# Altium schematic sheet PSU.SchDoc
size A3
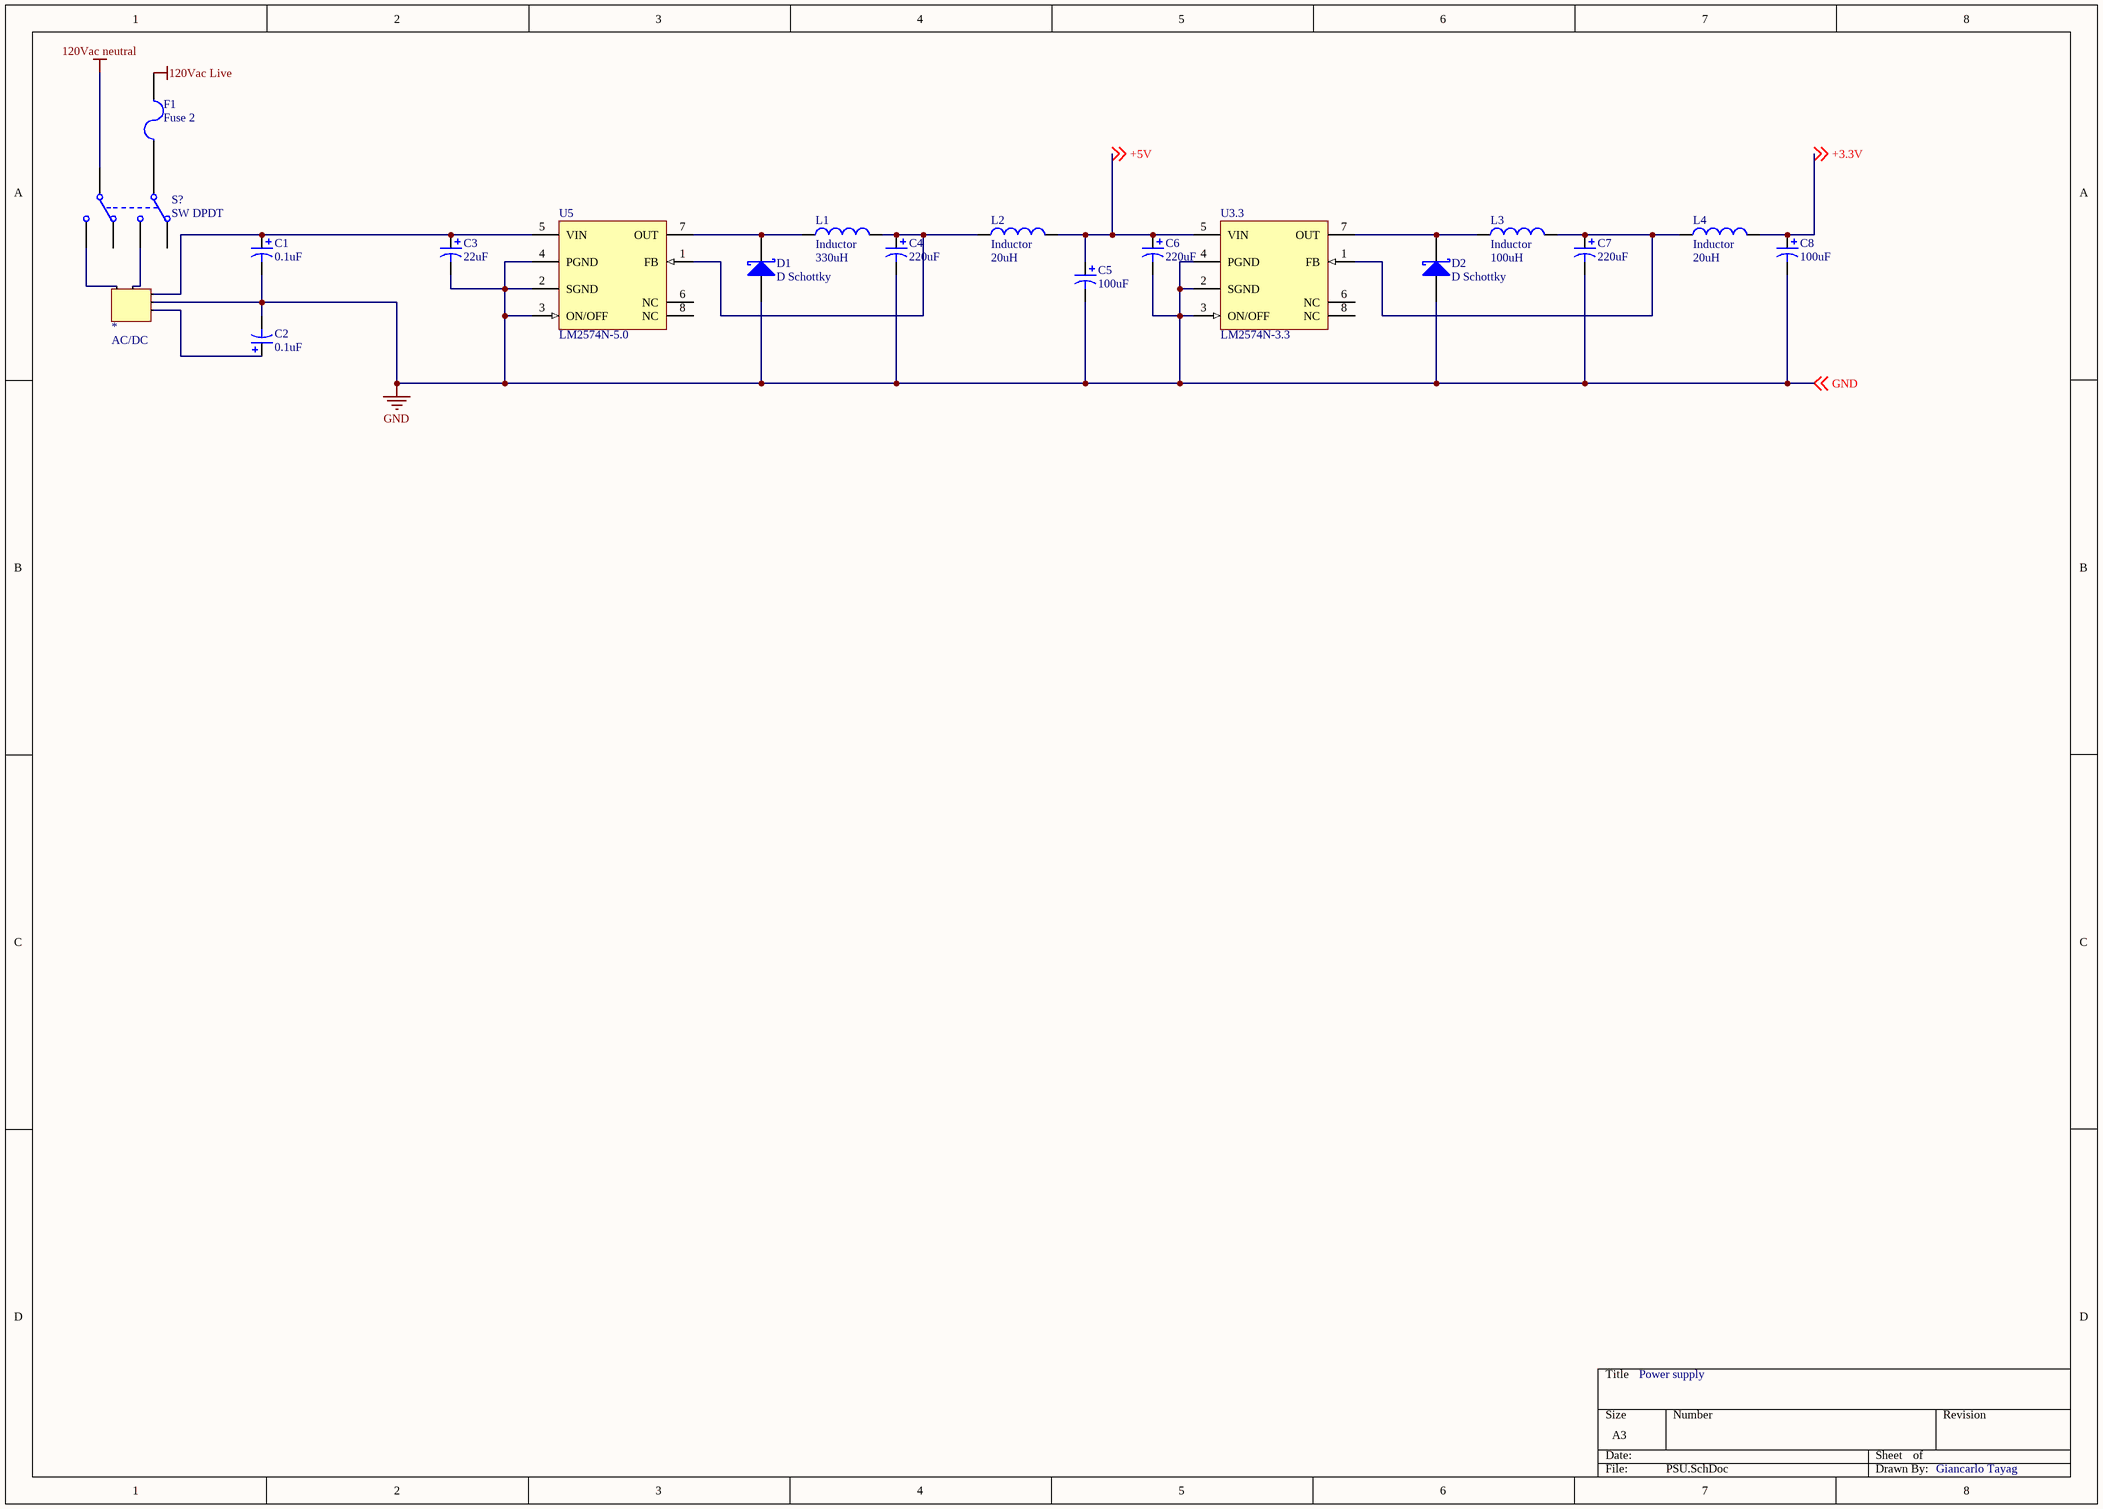
[diagram p0: PSU.SchDoc]

## Parts
*  AC/DC
C1  0.1uF  [CAPPR1.5-4X7]
C2  0.1uF  [CAPPR1.5-4X7]
C3  22uF  [C]
C4  220uF  [E]
C5  100uF  [E]
C6  220uF  [E]
C7  220uF  [C]
C8  100uF  [E]
D1  D Schottky  [SMB]
D2  D Schottky  [SMB]
F1  Fuse 2  [PIN-W2/E2.8]
L1  Inductor  value 330uH  [0603]
L2  Inductor  value 20uH  [0603]
L3  Inductor  value 100uH  [0603]
L4  Inductor  value 20uH  [0603]
S?  SW DPDT  [SOT23-6_N]
U3.3  LM2574N-3.3  [N08E]
U5  LM2574N-5.0  [N08E]

## Nets
120Vac Live: F1.2
120Vac neutral: S?.5(COMMON2)
GND: *.8 C1.2 C2.2 C3.2 C4.2 C5.2 C6.2 C7.2 C8.2 D1.1(A) D2.1(A) U3.3.2(SGND) U3.3.3(ON/OFF) U3.3.4(PGND) U5.2(SGND) U5.3(ON/OFF) U5.4(PGND) ; off-sheet GND
+3.3V: C8.1 L4.2 ; off-sheet +3.3V
+5V: C5.1 C6.1 L2.2 U3.3.5(VIN) ; off-sheet +5V
Net*_7: *.7 C1.1 C3.1 U5.5(VIN)
Net*_9: *.9 C2.1
Net*_10: *.10(N) S?.6(NO2)
Net*_11: *.11(L) S?.3(NO1)
NetC4_1: C4.1 L1.2 L2.1 U5.1(FB)
NetC7_1: C7.1 L3.2 L4.1 U3.3.1(FB)
NetD1_2: D1.2(K) L1.1 U5.7(OUT)
NetD2_2: D2.2(K) L3.1 U3.3.7(OUT)
NetF1_1: F1.1 S?.1(COMMON1)

Not connected (* = marked no-connect by the designer): S? 2(NC1) 4(NC2); U3.3 6(NC) 8(NC); U5 6(NC) 8(NC)

## Notes on the sheet
- Power supply
- Giancarlo Tayag

## Library data of the parts
C1 C2 = EKF00MM010J00: Aluminum Electrolytic Capacitor, Radial Style with Long Leads: 0.1uF, 63V; Note: Refer to Manufacturer's Data Sheets for other lead formations; DrillSize: Nominal, Rounded To The Nearest 0.05mm; Published: 19-Mar-2004; DatasheetDocument: 13-Jan-2000; PackageReference: CAPPR1.5-4X7; Publisher: Altium Limited; ComponentLink1Description: Manufacturer Link; ComponentLink1URL: http://www.vishay.com/; ComponentLink2Description: Datasheet; ComponentLink2URL: http://www.vishay.com/docs/25004/ekf.pdf; Value: 0.1uF
C3 C7 = 94SH226X0020CBP: Solid Aluminum Capacitor with Organic Semiconductor Electrolyte: 22uF, 20V, Bulk Pack; Note: Part Numbers shown are for ± 20% capacitance tolerance (X0).; PCB_Layout: Complies with Manufacturer's Recommendation.; DrillSize: Nominal, Rounded to the nearest 0.1mm; Published: 19-Mar-2004; DatasheetDocument: 23-May-2001; PackageReference: C; Publisher: Altium Limited; ComponentLink1Description: Manufacturer Link; ComponentLink1URL: http://www.vishay.com/; ComponentLink2Description: Datasheet; ComponentLink2URL: http://www.vishay.com/docs/90006/94sh.pdf; Value: 22uF
C4-C6 C8 = 94SS227X06R3EBP: Solid Aluminum Capacitor with Organic Semiconductor Electrolyte: 220uF, 6.3V, Bulk Pack; Note: Part Numbers shown are for ± 20% capacitance tolerance (X0).; PCB_Layout: Complies with Manufacturer's Recommendation.; DrillSize: Nominal, Rounded to the nearest 0.1mm; Published: 19-Mar-2004; DatasheetDocument: 23-May-2001; PackageReference: E; Publisher: Altium Limited; ComponentLink1Description: Manufacturer Link; ComponentLink1URL: http://www.vishay.com/; ComponentLink2Description: Datasheet; ComponentLink2URL: http://www.vishay.com/docs/90008/94ss.pdf; Value: 220uF
D1 D2 = D Schottky: Schottky Diode; Published: 8-Jun-2000; LatestRevisionDate: 17-Jul-2002; LatestRevisionNote: Re-released for DXP Platform.; PackageReference: SMB; Publisher: Altium Limited; PackageDescription: DO-214-AA/SMB; 2 C-Bend Leads; Body 5.3 x 3.6 mm, inc. leads (LxW); Code_JEDEC: DO-214-AA
F1 = Fuse 2: Fuse; Published: 8-Jun-2000; LatestRevisionDate: 17-Jul-2002; LatestRevisionNote: Re-released for DXP Platform.; PackageReference: PIN-W2/E2.8; Publisher: Altium Limited; PackageDescription: Thru-Hole; 2 Leads
L1-L4 = Inductor: Code_IEC: 1005; Published: 8-Jun-2000; LatestRevisionDate: 29-May-2009; LatestRevisionNote: IPC-7351 Footprint Added.; PackageReference: 0402-A; Publisher: Altium Limited; PackageDescription: Chip Inductor; Code_JEITA: 0402
S? = SW DPDT: Switch; Published: 24-Mar-1999; LatestRevisionDate: 29-May-2009; LatestRevisionNote: IPC-7351 Footprint Added.; PackageVersion: Mar-2001; PackageReference: SOT23-6; Publisher: Altium Limited; PackageDescription: 6-Pin SOT-23 Package 0.95 mm Pitch, 2.7 mm Lead Span; Code_JEITA: SC-74; Code_IPC: SOT26A-6
U3.3 = LM2574N-3.3: SIMPLE SWITCHER® 0.5A Step-Down Voltage Regulator, 8-pin MDIP; Manufacturer: National Semiconductor; PackageTopMarking: NSUZXYTTE#*LM2574N*-3.3 P+; PowerWise: N; High-Reliability: Y; DatasheetVersion: Jun-1999; PackageVersion: revG, May-2006; PackageReference: N08E; PackageDescription: MDIP, .365 x .250 x .130in, 8 Lead, .100in Pitch; PartNumber: LM2574N-3.3; RoHS: N; PinCount: 8; CompType: Switcher; Code_JEDEC: MS-001-BA; ComponentLink1Description: Manufacturer URL; ComponentLink1URL: http://www.national.com/; ComponentLink2Description: LM2574 Datasheet; ComponentLink2URL: http://www.national.com/ds/LM/LM2574.pdf; ComponentLink3Description: LM2574 Web Page; ComponentLink3URL: http://www.national.com/pf/LM/LM2574.html; ComponentLink4Description: N08E Package Page; ComponentLink4URL: http://www.national.com/packaging/folders/n08e.html
U5 = LM2574N-5.0: SIMPLE SWITCHER® 0.5A Step-Down Voltage Regulator, 8-pin MDIP; Manufacturer: National Semiconductor; PackageTopMarking: NSUZXYTTE#*LM2574N*-5.0 P+; PowerWise: N; High-Reliability: Y; DatasheetVersion: Jun-1999; PackageVersion: revG, May-2006; PackageReference: N08E; PackageDescription: MDIP, .365 x .250 x .130in, 8 Lead, .100in Pitch; PartNumber: LM2574N-5.0; RoHS: N; PinCount: 8; CompType: Switcher; Code_JEDEC: MS-001-BA; ComponentLink1Description: Manufacturer URL; ComponentLink1URL: http://www.national.com/; ComponentLink2Description: LM2574 Datasheet; ComponentLink2URL: http://www.national.com/ds/LM/LM2574.pdf; ComponentLink3Description: LM2574 Web Page; ComponentLink3URL: http://www.national.com/pf/LM/LM2574.html; ComponentLink4Description: N08E Package Page; ComponentLink4URL: http://www.national.com/packaging/folders/n08e.html